# Altium schematic sheet terms.SchDoc
size A4
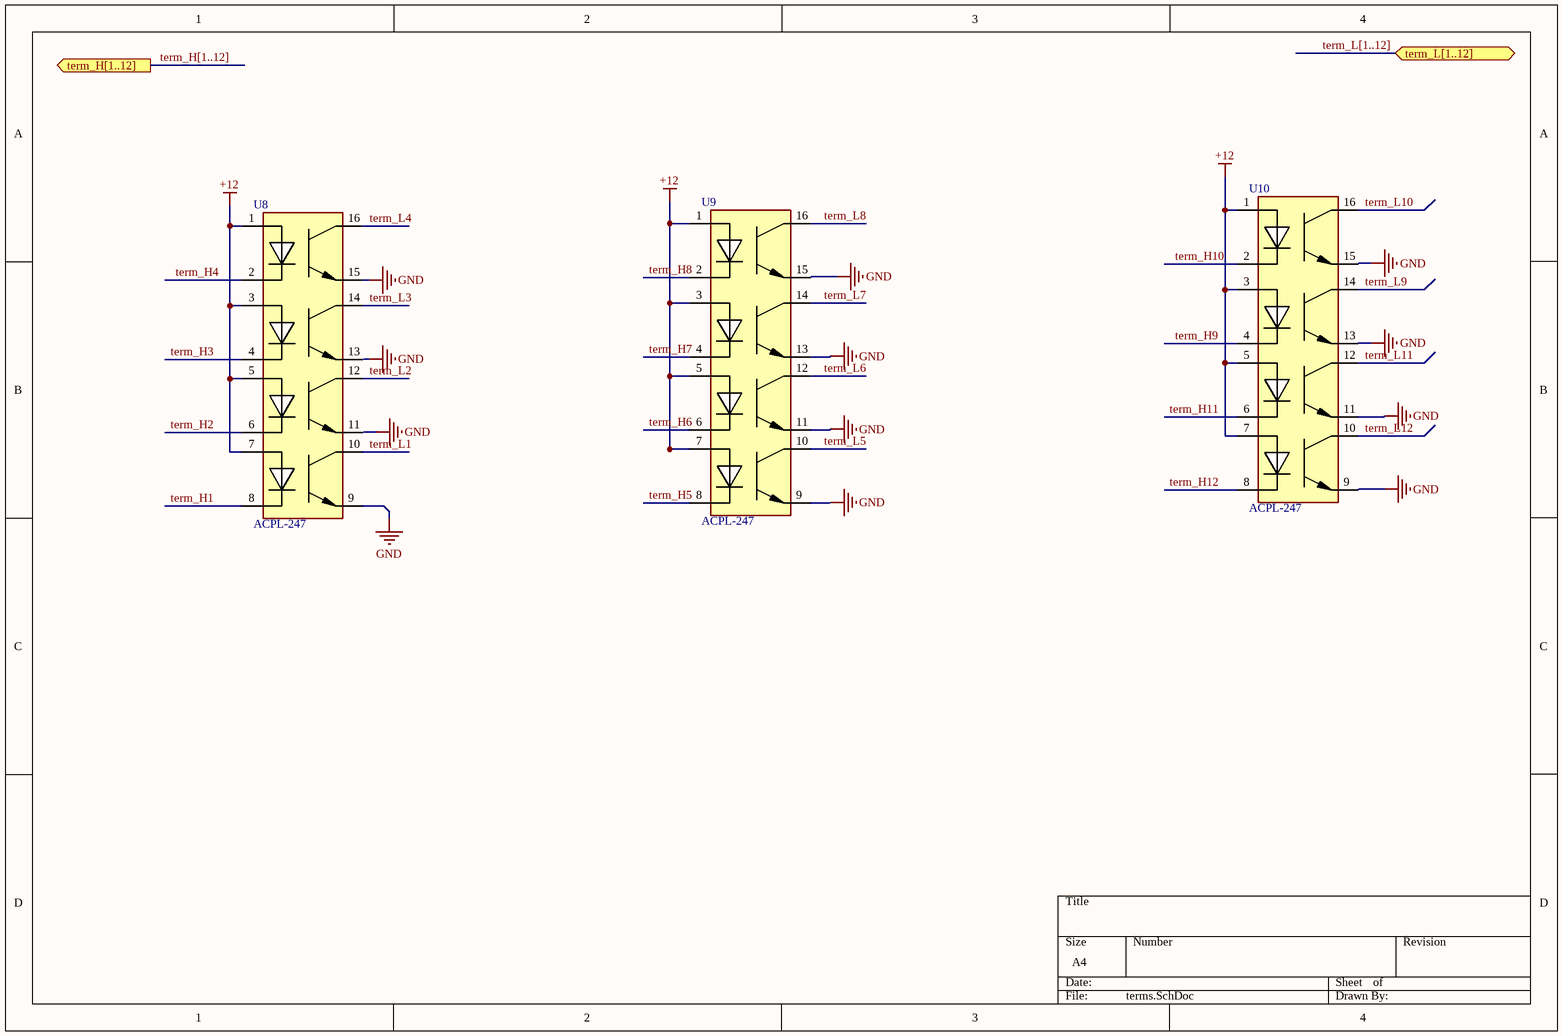
[diagram p0: terms.SchDoc]

## Parts
U8  ACPL-247  [SOIC127P600-16M]
U9  ACPL-247  [SOIC127P600-16M]
U10  ACPL-247  [SOIC127P600-16M]

## Ports
term_H[1..12] (out), term_L[1..12]

## Nets
+12: U8.1 U8.3 U8.5 U8.7 U9.1 U9.3 U9.5 U9.7 U10.1 U10.3 U10.5 U10.7
GND: U8.9 U8.11 U8.13 U8.15 U9.9 U9.11 U9.13 U9.15 U10.9 U10.11 U10.15
term_H1: U8.8
term_H2: U8.6
term_H3: U8.4
term_H4: U8.2
term_H5: U9.8
term_H6: U9.6
term_H7: U9.4
term_H8: U9.2
term_H9: U10.4
term_H10: U10.2
term_H11: U10.6
term_H12: U10.8
term_L1: U8.10
term_L2: U8.12
term_L3: U8.14
term_L4: U8.16
term_L5: U9.10
term_L6: U9.12
term_L7: U9.14
term_L8: U9.16
term_L9: U10.14
term_L10: U10.16
term_L11: U10.12
term_L12: U10.10

Not connected (* = marked no-connect by the designer): U10 13

## Buses and harness runs
bus term_H[1..12] = port term_H[1..12]
bus term_L[1..12] = port term_L[1..12]

## Library data of the parts
U8-U10 = ACPL-247: DC Input Multi-Channel Half-Pitch  Phototransistor Optocoupler